# EAGLE design mm2-ringlight (EAGLE 6.3)
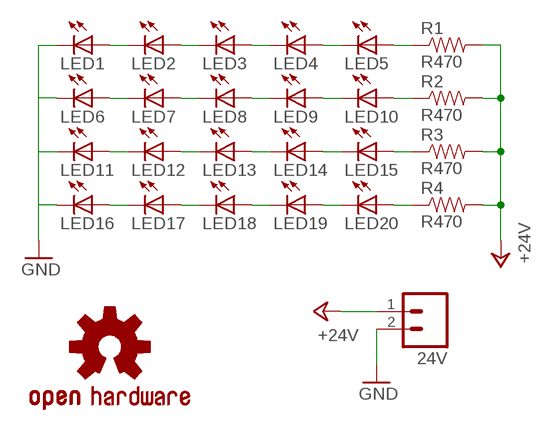
[diagram p0: schematic, sheet 1]

## Parts
24V  M02PTH  [1X02]
LED1  LEDCHIPLED_0805  [CHIPLED_0805]
LED2  LEDCHIPLED_0805  [CHIPLED_0805]
LED3  LEDCHIPLED_0805  [CHIPLED_0805]
LED4  LEDCHIPLED_0805  [CHIPLED_0805]
LED5  LEDCHIPLED_0805  [CHIPLED_0805]
LED6  LEDCHIPLED_0805  [CHIPLED_0805]
LED7  LEDCHIPLED_0805  [CHIPLED_0805]
LED8  LEDCHIPLED_0805  [CHIPLED_0805]
LED9  LEDCHIPLED_0805  [CHIPLED_0805]
LED10  LEDCHIPLED_0805  [CHIPLED_0805]
LED11  LEDCHIPLED_0805  [CHIPLED_0805]
LED12  LEDCHIPLED_0805  [CHIPLED_0805]
LED13  LEDCHIPLED_0805  [CHIPLED_0805]
LED14  LEDCHIPLED_0805  [CHIPLED_0805]
LED15  LEDCHIPLED_0805  [CHIPLED_0805]
LED16  LEDCHIPLED_0805  [CHIPLED_0805]
LED17  LEDCHIPLED_0805  [CHIPLED_0805]
LED18  LEDCHIPLED_0805  [CHIPLED_0805]
LED19  LEDCHIPLED_0805  [CHIPLED_0805]
LED20  LEDCHIPLED_0805  [CHIPLED_0805]
R1  R470  RESISTOR0805-RES  [0805]
R2  R470  RESISTOR0805-RES  [0805]
R3  R470  RESISTOR0805-RES  [0805]
R4  R470  RESISTOR0805-RES  [0805]
U$1  OSHW-LOGOS  [OSHW-LOGO-S]

## Nets
+24V: 24V.1 R1.2 R2.2 R3.2 R4.2
GND [power]: 24V.2 LED1.C LED6.C LED11.C LED16.C
N$1: LED5.A R1.1
N$2: LED16.A LED17.C
N$3: LED17.A LED18.C
N$4: LED18.A LED19.C
N$5: LED19.A LED20.C
N$6: LED14.A LED15.C
N$7: LED13.A LED14.C
N$8: LED12.A LED13.C
N$9: LED11.A LED12.C
N$10: LED6.A LED7.C
N$11: LED7.A LED8.C
N$12: LED8.A LED9.C
N$13: LED9.A LED10.C
N$14: LED4.A LED5.C
N$15: LED3.A LED4.C
N$16: LED2.A LED3.C
N$17: LED1.A LED2.C
N$18: LED10.A R2.1
N$19: LED15.A R3.1
N$20: LED20.A R4.1

## Library data of the parts
24V = SparkFun:M02: Header 2 Standard 2-pin 0.1" header. Use with straight break away headers (SKU : PRT-00116), right angle break away headers (PRT-00553), swiss pins (PRT-00743), machine pins (PRT-00117), and female headers (PRT-00115). Molex polarized connector foot print use with SKU : PRT-08233 with associated crimp pins and housings.
LED1-LED20 = adafruit:LED: LED OSRAM: - CHIPLED LG R971, LG N971, LY N971, LG Q971, LY Q971, LO R971, LY R971 LH N974, LH R974 LS Q976, LO Q976, LY Q976 LO Q996 - Hyper CHIPLED LW Q18S LB Q993, LB Q99A, LB R99A - SideLED LS A670, LO A670, LY A670, LG A670, LP A670 LB A673, LV A673, LT A673, LW A673 LH A674 LY A675 LS A676, LA A676, LO A676, LY A676, LW A676 LS A679, LY A679, LG A679 - Hyper Micro SIDELED® LS Y876, LA Y876, LO Y876, LY Y876 LT Y87S - SmartLED LW L88C, LW L88S LB L89C, LB L89S, LG L890 LS L89K, LO L89K, LY L89K LS L896, LA L896, LO L896, LY L896 - TOPLED LS T670, LO T670, LY T670, LG T670, LP T670 LSG T670, LSP T670, LSY T670, LOP T670, LYG T670 LG T671, LOG T671, LSG T671 LB T673, LV T673, LT T673, LW T673 LH T674 LS T676, LA T676, LO T676, LY T676, LB T676, LH T676, LSB T676, LW T676 LB T67C, LV T67C, LT T67C, LS T67K, LO T67K, LY T67K, LW E67C LS E67B, LA E67B, LO E67B, LY E67B, LB E67C, LV E67C, LT E67C LW T67C LS T679, LY T679, LG T679 LS T770, LO T770, LY T770, LG T770, LP T770 LB T773, LV T773, LT T773, LW T773 LH T774 LS E675, LA E675, LY E675, LS T675 LS T776, LA T776, LO T776, LY T776, LB T776 LHGB T686 LT T68C, LB T68C - Hyper Mini TOPLED® LB M676 - Mini TOPLED Santana® LG M470 LS M47K, LO M47K, LY M47K Source: http://www.osram.convergy.de/
R1-R4 = SparkFun:RESISTOR: Resistor Basic schematic elements and footprints for 0603, 1206, and PTH resistors.
U$1 = SparkFun:OSHW-LOGO: Open Source Hardware Logo This logo indicates the piece of hardware it is found on incorporates a OSHW license and/or adheres to the definition of open source hardware found here: http://freedomdefined.org/OSHW

## Net classes
0 default: width 0.008 mm
1 power: width 0.4 mm

## Board
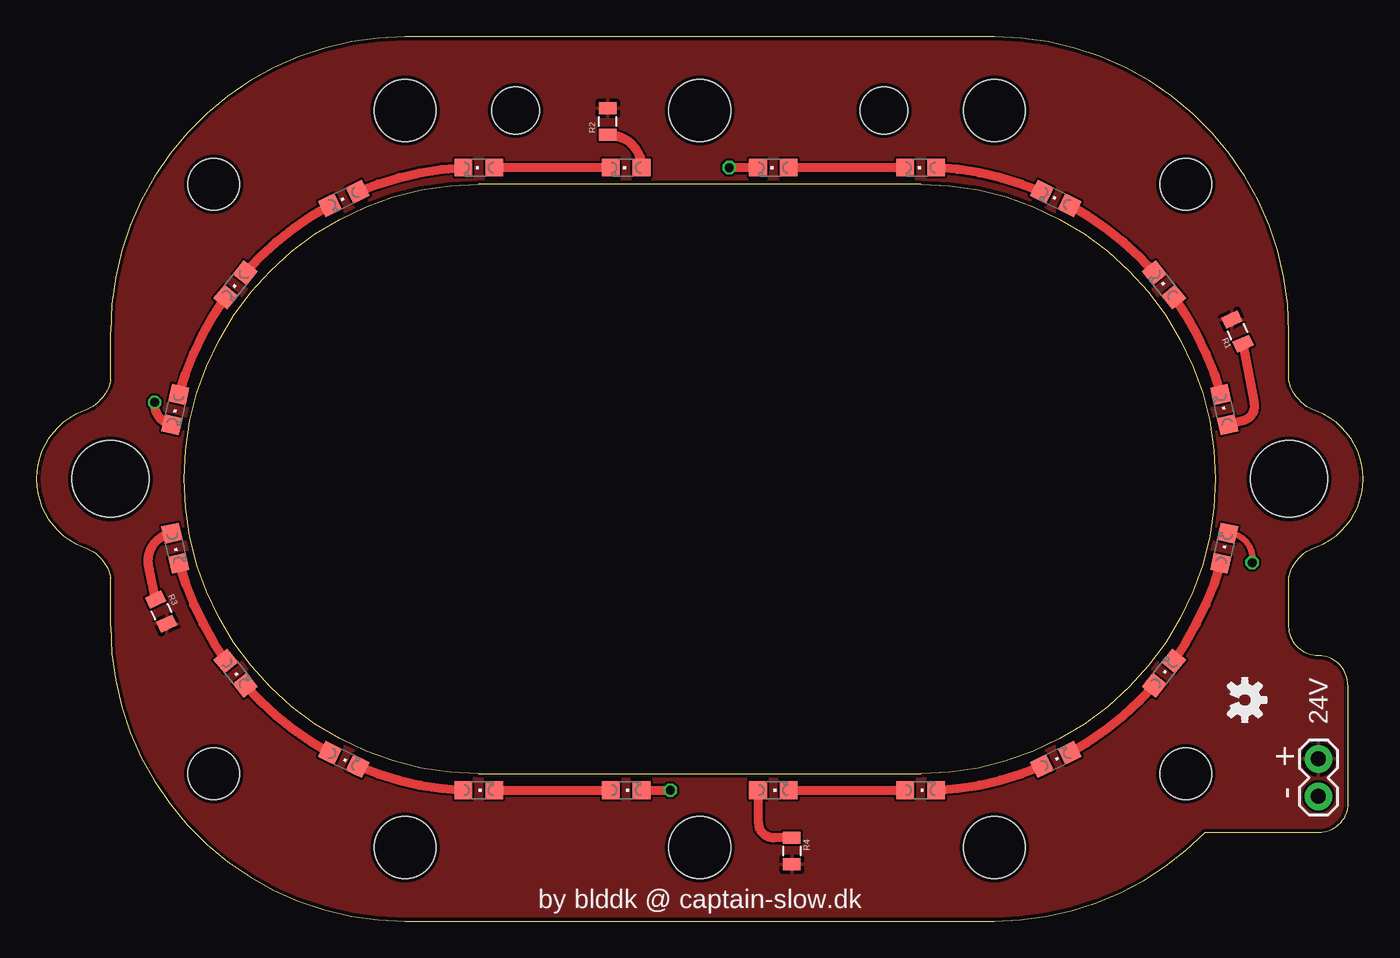
[diagram p1: board, top side]
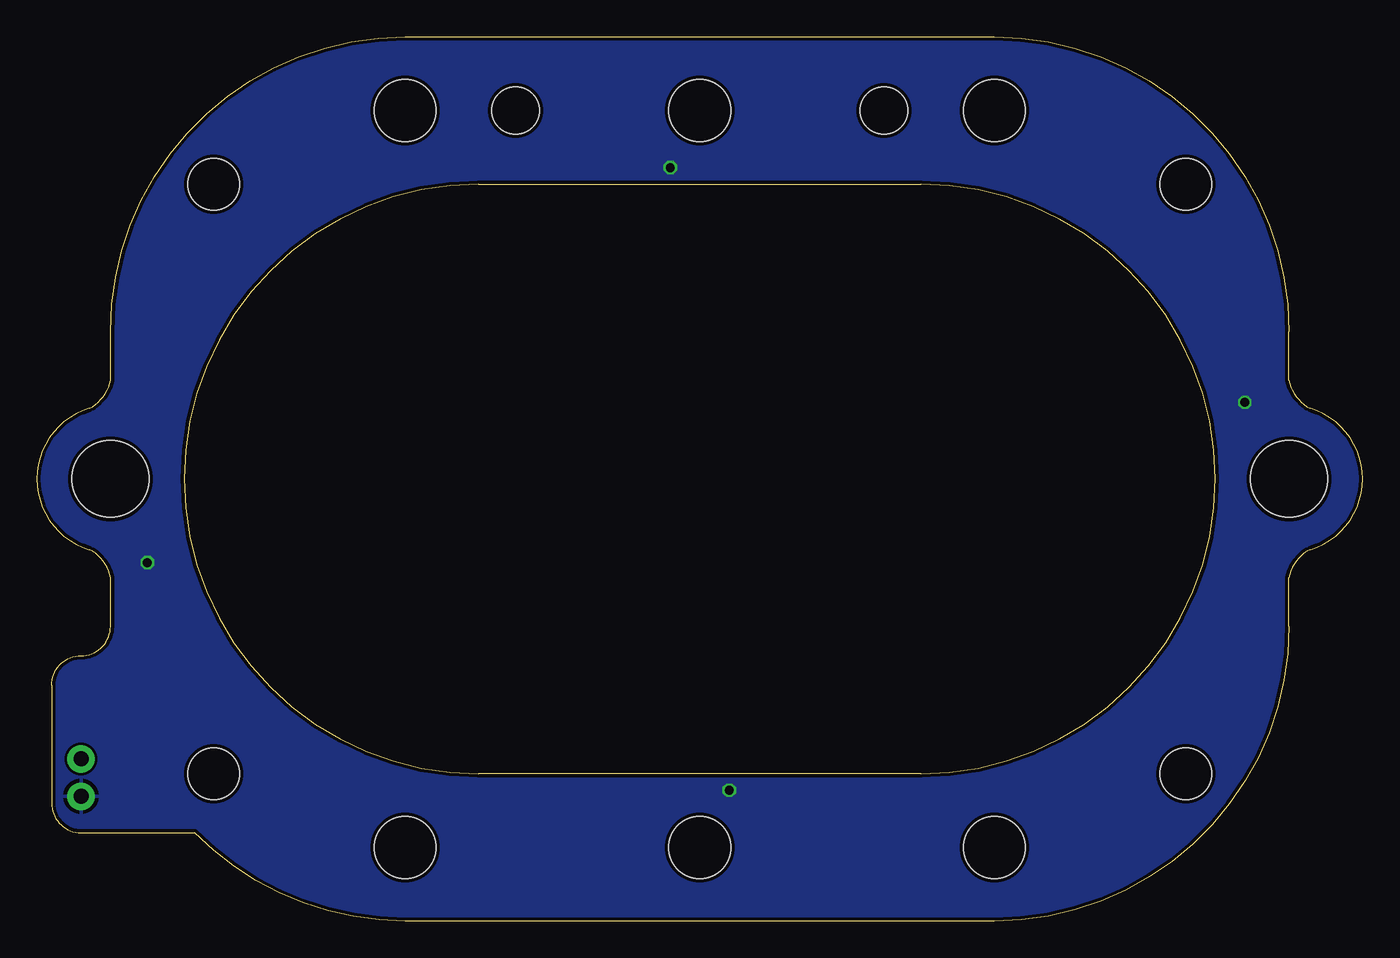
[diagram p2: board, bottom side, seen from below]

Size 90 x 60 mm. Coordinates in mm from the lower left corner, seen from the top.
Outline: 65,60 25,60 arc90 5,40 5,36.71 arc-52 3.57,34.79 arc147 3.57,25.21 arc-52 5,23.29 5,20 arc90 25,0 65,0 arc46 79.28,6 87,6 arc90 89,8 89,16 arc90 87,18 arc-90 85,20 85,23.29 arc-52 86.43,25.21 arc147 86.43,34.79 arc-52 85,36.71 85,40 arc90 65,60
Outline: 30,10 arc-180 30,50 60,50 arc-180 60,10 30,10
Copper layers (1*16): Top 0.035mm / dielectric 1.5mm / Bottom 0.035mm
Design rules "ITEADstudio_DRC": minimum track width 6mil, minimum drill 12mil, track to track 6mil, track to pad 6mil, pad to pad 6mil, via to via 6mil, smd to smd 0mil, copper to edge 10mil, drill to drill 10mil, minimum pad ring 10mil, minimum via ring 6mil, stop-mask expansion 2mil, vias tented up to drill 100mil, thermal gap 10mil
Holes 5.2 mm at 85,30 5,30
Holes 3.5 mm at 78,50 78,10 12,50 12,10 78,50
Holes 4.2 mm at 25,55 45,55 65,55 65,5 45,5 25,5
Holes 3.2 mm at 57.5,55 32.5,55

### Footprints (pad centres in the part's own frame; a part is rotated, then mirrored left to right if it is on the bottom)
1X02 = drill 1.016 pad 1.88: 1 0,0; 2 2.54,0
CHIPLED_0805 = smd 1.2 x 1.2: A 0,-1.05; C 0,1.05
0805 = smd 0.8 x 1.2: 1 -0.9,0; 2 0.9,0

### Placement (x,y rotation side)
24V  87,11 270 top
LED1  50,51.12 90 top
LED2  60,51.12 90 top
LED3  69.17,49.03 64.2 top
LED4  76.52,43.17 38.6 top
LED5  80.6,34.7 12.8 top
LED6  9.41,34.7 167.2 top
LED7  13.48,43.17 141.4 top
LED8  20.83,49.03 115.8 top
LED9  30,51.12 90 top
LED10  40,51.12 90 top
LED11  40,8.88 270 top
LED12  30,8.88 270 top
LED13  20.83,10.97 244.2 top
LED14  13.48,16.83 218.6 top
LED15  9.41,25.3 192.8 top
LED16  80.6,25.3 347.2 top
LED17  76.52,16.83 321.4 top
LED18  69.17,10.97 295.8 top
LED19  60,8.88 270 top
LED20  50,8.88 270 top
R1  81.5,40 115 top
R2  38.75,54.25 90 top
R3  8.45,21 295 top
R4  51.25,4.75 270 top
U$1  82,15 270 top

### Tracks (layer width: path | path; a pad name or v marks a point on that pad's centre or on a via)
+24V
  pour Top: 92,62 92,-2 -2,-2 -2,60 arc-90 0,62
GND  (via drill 0.6)
  Top 0.406: LED16.C arc-90 82.5,24.65 v82.5,24.32
  Top 0.61: LED1.C v47,51.12 | LED6.C 9.01,33.72 arc-75 8,35.05 arc90 v8,35.2 | LED11.C v43,8.88
  pour Bottom: 91,61 91,-1 -1,-1 -1,61
N$1
  Top 0.61: LED5.A 81.1,34 | R1.1 82.63,35.11 arc-86 81.91,33.96 LED5.A | 81.09,33.75 LED5.A
N$2
  Top 0.61: LED17.C arc20 LED16.A
N$3
  Top 0.61: LED18.C arc20 LED17.A
N$4
  Top 0.61: LED19.C arc20 LED18.A
N$5
  Top 0.61: LED20.C LED19.A
N$6
  Top 0.61: LED15.C arc20 LED14.A
N$7
  Top 0.61: LED14.C arc20 LED13.A
N$8
  Top 0.61: LED13.C arc20 LED12.A
N$9
  Top 0.61: LED12.C LED11.A
N$10
  Top 0.61: LED6.A arc-20 LED7.C
N$11
  Top 0.61: LED7.A arc-20 LED8.C
N$12
  Top 0.61: LED8.A arc-20 LED9.C
N$13
  Top 0.61: LED10.C LED9.A
N$14
  Top 0.61: LED4.A arc-20 LED5.C
N$15
  Top 0.61: LED4.C arc20 LED3.A
N$16
  Top 0.61: LED3.C arc20 LED2.A
N$17
  Top 0.61: LED2.C LED1.A
N$18
  Top 0.61: R2.1 38.83,53.35 arc-90 LED10.A
N$19
  Top 0.61: R3.1 7.64,23.9 arc-98 LED15.A
N$20
  Top 0.61: R4.1 50,5.65 arc-90 49,6.65 49,8.8 LED20.A

### Text on the board
tNames: + | - | by blddk @ captain-slow.dk